# EAGLE design MinimumSistem (EAGLE 6.2)
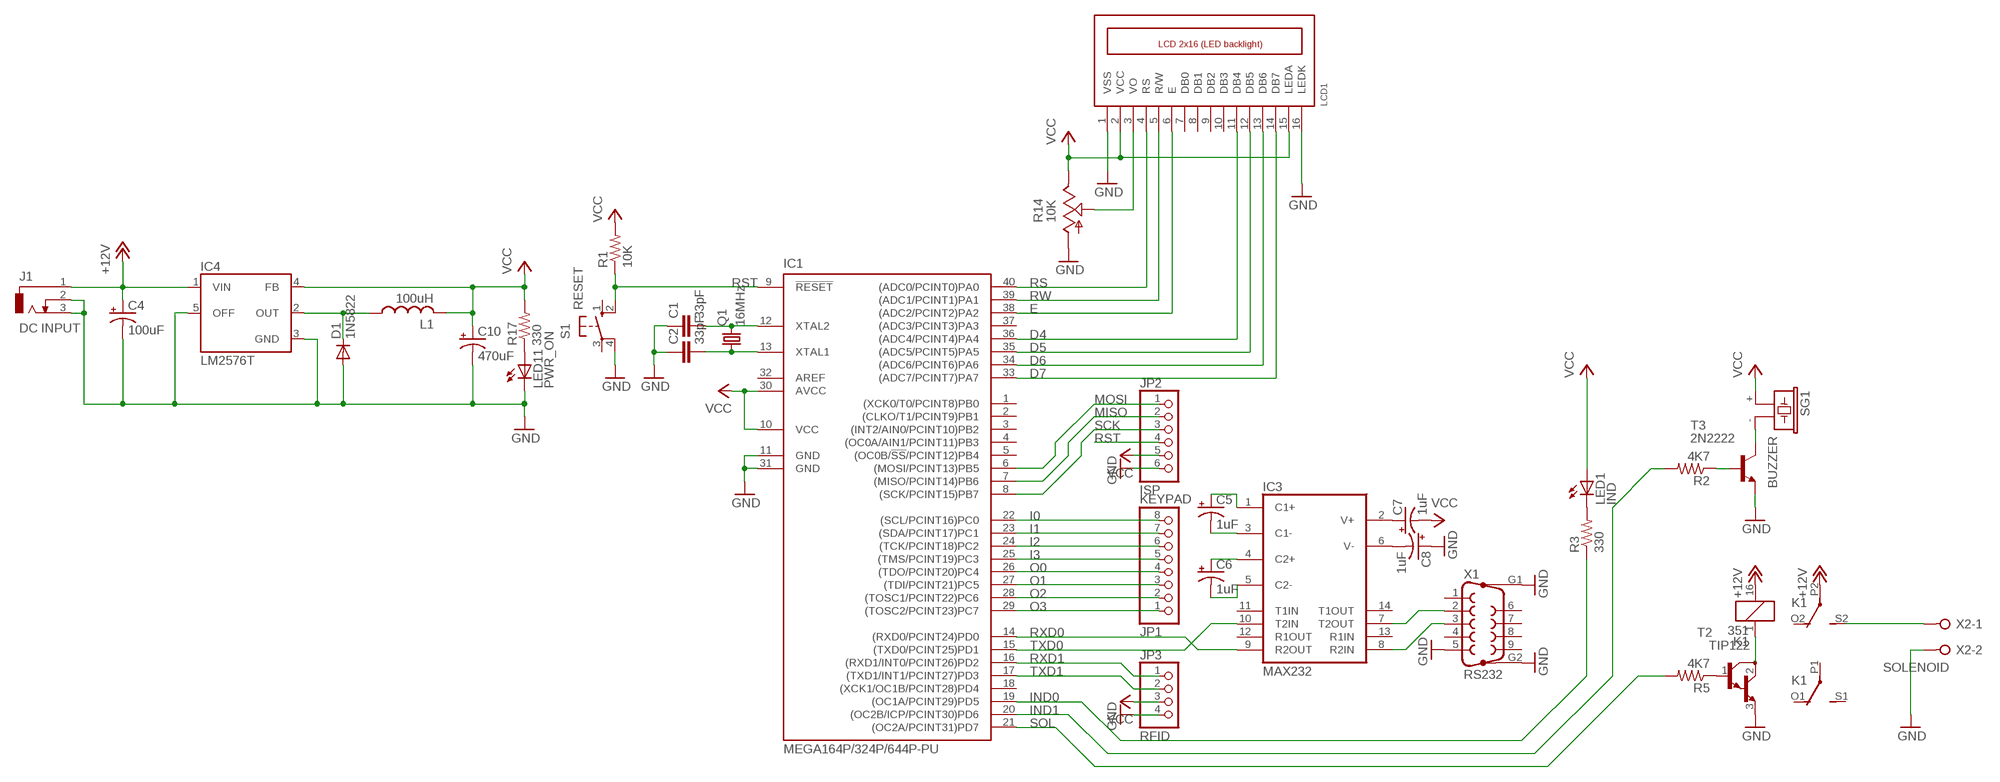
[diagram p0: schematic, sheet 1]

## Parts
C1  33pF  C-EU025-024X044  [C025-024X044]
C2  33pF  C-EU025-024X044  [C025-024X044]
C4  100uF  CPOL-USE2.5-6  [E2,5-6]
C5  1uF  CPOL-USE2-4  [E2-4]
C6  1uF  CPOL-USE2-4  [E2-4]
C7  1uF  CPOL-USE2-4  [E2-4]
C8  1uF  CPOL-USE2-4  [E2-4]
C10  470uF  CPOL-USE3.5-8  [E3,5-8]
D1  1N5822  1N5400  [DO201-15]
IC1  MEGA164P/324P/644P-PU  [DIL40]
IC3  MAX232  [DIL16]
IC4  LM2576T  [TO220-5]
J1  DC INPUT  DCJ0202  [DCJ0202]
JP1  KEYPAD  PINHD-1X8/90  [1X08/90]
JP2  ISP  PINHD-1X6  [1X06]
JP3  RFID  PINHD-1X4  [1X04]
K1  351  [351]
L1  100uH  L-USTJ3-U2  [TJ3-U2]
LCD1  LCD_2X16  LCD_2X16_SIL  [HY-1602F]
LED1  IND  LED5MM  [LED5MM]
LED11  PWR_ON  LED3MM  [LED3MM]
Q1  16MHz  CRYSTALHC49S  [HC49/S]
R1  10K  R-US_0207/10  [0207/10]
R2  4K7  R-US_0207/10  [0207/10]
R3  330  R-US_0207/10  [0207/10]
R5  4K7  R-US_0207/10  [0207/10]
R14  10K  TRIM_US-CA6V  [CA6V]
R17  330  R-US_0207/10  [0207/10]
S1  RESET  10-XX  [B3F-10XX]
SG1  BUZZER  F/CM12P  [F/CM12P]
T2  TIP122  [TO220]
T3  2N2222  [TO92-EBC-OVAL]
X1  RS232  F09HP  [F09HP]
X2  SOLENOID  W237-02P  [W237-132]

## Nets
+12V [power]: C4.+ IC4.1(VIN) J1.1 K1.16 K1.P2(3:P)
D4: IC1.36((ADC4/PCINT4)PA4) LCD1.11(DB4)
D5: IC1.35((ADC5/PCINT5)PA5) LCD1.12(DB5)
D6: IC1.34((ADC6/PCINT6)PA6) LCD1.13(DB6)
D7: IC1.33((ADC7/PCINT7)PA7) LCD1.14(DB7)
E: IC1.38((ADC2/PCINT2)PA2) LCD1.6(E)
GND [gnd]: C1.1 C2.1 C4.- C8.+ C10.- D1.A IC1.11(GND) IC1.31(GND) IC4.3(GND) IC4.5(OFF) J1.2 J1.3 JP2.6 JP3.4 LCD1.1(VSS) LCD1.16(LEDK) LED11.K(C) R14.A S1.4(P1) T2.3(E) T3.E X1.5 X1.G1 X1.G2 X2.2
I0: IC1.22((SCL/PCINT16)PC0) JP1.8
I1: IC1.23((SDA/PCINT17)PC1) JP1.7
I2: IC1.24((TCK/PCINT18)PC2) JP1.6
I3: IC1.25((TMS/PCINT19)PC3) JP1.5
IND0: IC1.19((OC1A/PCINT29)PD5) R3.1
IND1: IC1.20((OC2B/ICP/PCINT30)PD6) R2.2
MISO: IC1.7((MISO/PCINT14)PB6) JP2.2
MOSI: IC1.6((MOSI/PCINT13)PB5) JP2.1
N$1: C1.2 IC1.12(XTAL2) Q1.2
N$2: C2.2 IC1.13(XTAL1) Q1.1
N$3: R5.1 T2.1(B)
N$4: K1.1 T2.2(C)
N$5 [vcc]: LED1.K(C) R3.2
N$6: K1.S2(3:S) X2.1
N$7: R2.1 T3.B
N$16: SG1.- T3.C
N$17: C5.- IC3.3(C1-)
N$18: C6.+ IC3.4(C2+)
N$19: C5.+ IC3.1(C1+)
N$20: C6.- IC3.5(C2-)
N$21: C7.+ IC3.2(V+)
N$22: C8.- IC3.6(V-)
N$23: IC3.7(T2OUT) X1.2
N$24: IC3.8(R2IN) X1.3
N$27: LCD1.3(VO) R14.S
N$32: D1.C IC4.2(OUT) L1.1
N$33: LED11.A R17.1
O0: IC1.26((TDO/PCINT20)PC4) JP1.4
O1: IC1.27((TDI/PCINT21)PC5) JP1.3
O2: IC1.28((TOSC1/PCINT22)PC6) JP1.2
O3: IC1.29((TOSC2/PCINT23)PC7) JP1.1
RS: IC1.40((ADC0/PCINT0)PA0) LCD1.4(RS)
RST: IC1.9(!RESET) JP2.4 R1.1 S1.2(S1)
RW: IC1.39((ADC1/PCINT1)PA1) LCD1.5(R/W)
RXD0: IC1.14((RXD0/PCINT24)PD0) IC3.9(R2OUT)
RXD1: IC1.16((RXD1/INT0/PCINT26)PD2) JP3.1
SCK: IC1.8((SCK/PCINT15)PB7) JP2.3
SOL: IC1.21((OC2A/PCINT31)PD7) R5.2
TXD0: IC1.15((TXD0/PCINT25)PD1) IC3.10(T2IN)
TXD1: IC1.17((TXD1/INT1/PCINT27)PD3) JP3.2
VCC [vcc]: C7.- C10.+ IC1.10(VCC) IC1.30(AVCC) IC4.4(FB) JP2.5 JP3.3 L1.2 LCD1.2(VCC) LCD1.15(LEDA) LED1.A R1.2 R14.E R17.2 SG1.+
Unconnected: IC1.1((XCK0/T0/PCINT8)PB0) IC1.2((CLKO/T1/PCINT9)PB1) IC1.3((INT2/AIN0/PCINT10)PB2) IC1.4((OC0A/AIN1/PCINT11)PB3) IC1.5((OC0B/!SS!/PCINT12)PB4) IC1.18((XCK1/OC1B/PCINT28)PD4) IC1.37((ADC3/PCINT3)PA3) IC3.11(T1IN) IC3.12(R1OUT) IC3.13(R1IN) IC3.14(T1OUT) K1.O1(2:O) K1.O2(3:O) K1.P1(2:P) K1.S1(2:S) LCD1.7(DB0) LCD1.8(DB1) LCD1.9(DB2) LCD1.10(DB3) S1.1(S) S1.3(P) X1.1 X1.4 X1.6 X1.7 X1.8 X1.9

## Power pins joined to a net without a drawn wire
AREF: IC1.32(AREF)
GND: IC3.15(GND)
VCC: IC3.16(VCC)

## Library data of the parts
C1 C2 = resistor:C-EU: CAPACITOR, European symbol
C4-C8 C10 = resistor:CPOL-US: POLARIZED CAPACITOR, American symbol
D1 = diode:1N5400: DIODE standard rectifier, 3 A, 50 V (Motorola)
IC1 = avr-7:MEGA164P/324P/644P-PU
IC3 = maxim:MAX232: RS232 TRANSEIVER; MF: MAXIM; MPN: MAX232ACPE+; OC_FARNELL: 9723773; OC_NEWARK: 68K4544
IC4 = v-reg-3:LM2576: National Semiconductor <http://www.national.com> 3.0A "Simple Switcher"(c) 52kHz, Vout 1.23-37V (HV: 57V), Vin 40V (HV: 60V), 50µA standby current
J1 = con-jack:DCJ0202: DC POWER JACK Source: DCJ0202.pdf; OC_FARNELL: unknown; OC_NEWARK: unknown
JP1 = pinhead:PINHD-1X8: PIN HEADER
JP2 = pinhead:PINHD-1X6: PIN HEADER
JP3 = pinhead:PINHD-1X4: PIN HEADER
K1 = relay:351: RELAY 2 x switch, Omron; OC_FARNELL: unknown; OC_NEWARK: unknown
L1 = resistor:L-US: INDUCTOR, American symbol
LCD1 = lcd_2x16_led_backlight:LCD_2X16_SIL
LED1 LED11 = led:LED: LED OSRAM: - CHIPLED LG R971, LG N971, LY N971, LG Q971, LY Q971, LO R971, LY R971 LH N974, LH R974 LS Q976, LO Q976, LY Q976 LO Q996 - Hyper CHIPLED LW Q18S LB Q993, LB Q99A, LB R99A - SideLED LS A670, LO A670, LY A670, LG A670, LP A670 LB A673, LV A673, LT A673, LW A673 LH A674 LY A675 LS A676, LA A676, LO A676, LY A676, LW A676 LS A679, LY A679, LG A679 - Hyper Micro SIDELED® LS Y876, LA Y876, LO Y876, LY Y876 LT Y87S - SmartLED LW L88C, LW L88S LB L89C, LB L89S, LG L890 LS L89K, LO L89K, LY L89K LS L896, LA L896, LO L896, LY L896 - TOPLED LS T670, LO T670, LY T670, LG T670, LP T670 LSG T670, LSP T670, LSY T670, LOP T670, LYG T670 LG T671, LOG T671, LSG T671 LB T673, LV T673, LT T673, LW T673 LH T674 LS T676, LA T676, LO T676, LY T676, LB T676, LH T676, LSB T676, LW T676 LB T67C, LV T67C, LT T67C, LS T67K, LO T67K, LY T67K, LW E67C LS E67B, LA E67B, LO E67B, LY E67B, LB E67C, LV E67C, LT E67C LW T67C LS T679, LY T679, LG T679 LS T770, LO T770, LY T770, LG T770, LP T770 LB T773, LV T773, LT T773, LW T773 LH T774 LS E675, LA E675, LY E675, LS T675 LS T776, LA T776, LO T776, LY T776, LB T776 LHGB T686 LT T68C, LB T68C - Hyper Mini TOPLED® LB M676 - Mini TOPLED Santana® LG M470 LS M47K, LO M47K, LY M47K Source: http://www.osram.convergy.de LUXEON: - LUMILED® LXK2-PW12-R00, LXK2-PW12-S00, LXK2-PW14-U00, LXK2-PW14-V00 LXK2-PM12-R00, LXK2-PM12-S00, LXK2-PM14-U00 LXK2-PE12-Q00, LXK2-PE12-R00, LXK2-PE12-S00, LXK2-PE14-T00, LXK2-PE14-U00 LXK2-PB12-K00, LXK2-PB12-L00, LXK2-PB12-M00, LXK2-PB14-N00, LXK2-PB14-P00, LXK2-PB14-Q00 LXK2-PR12-L00, LXK2-PR12-M00, LXK2-PR14-Q00, LXK2-PR14-R00 LXK2-PD12-Q00, LXK2-PD12-R00, LXK2-PD12-S00 LXK2-PH12-R00, LXK2-PH12-S00 LXK2-PL12-P00, LXK2-PL12-Q00, LXK2-PL12-R00 Source: www.luxeon.com KINGBRIGHT: KA-3528ASYC Source: www.kingbright.com
Q1 = crystal:CRYSTAL: CRYSTAL; OC_FARNELL: 1667008; OC_NEWARK: unknown
R1-R3 R5 R17 = resistor:R-US_: RESISTOR, American symbol
R14 = pot:TRIM_US-: POTENTIOMETER
S1 = switch-omron:10-XX: OMRON SWITCH; MPN: B3F-1000; OC_FARNELL: 176432; OC_NEWARK: 36M3542
SG1 = buzzer:F/CM12P: BUZZER Source: Buerklin; OC_FARNELL: unknown; OC_NEWARK: unknown
T2 = transistor-neu-to92:TIP122: NPN BIPOLAR DARLINGTON TRANSISTOR
T3 = adafruit:2N2222: NPN TRANSISTOR Big oval pads
X1 = con-subd:F09HP: SUB-D; OC_FARNELL: unknown; OC_NEWARK: unknown
X2 = con-wago-508:W237-02P: WAGO SREW CLAMP; OC_FARNELL: unknown; OC_NEWARK: unknown

## Net classes
0 default: width 0.5 mm
1 power: width 1 mm
2 gnd: width 0.6 mm
3 vcc: width 0.7 mm

## Board
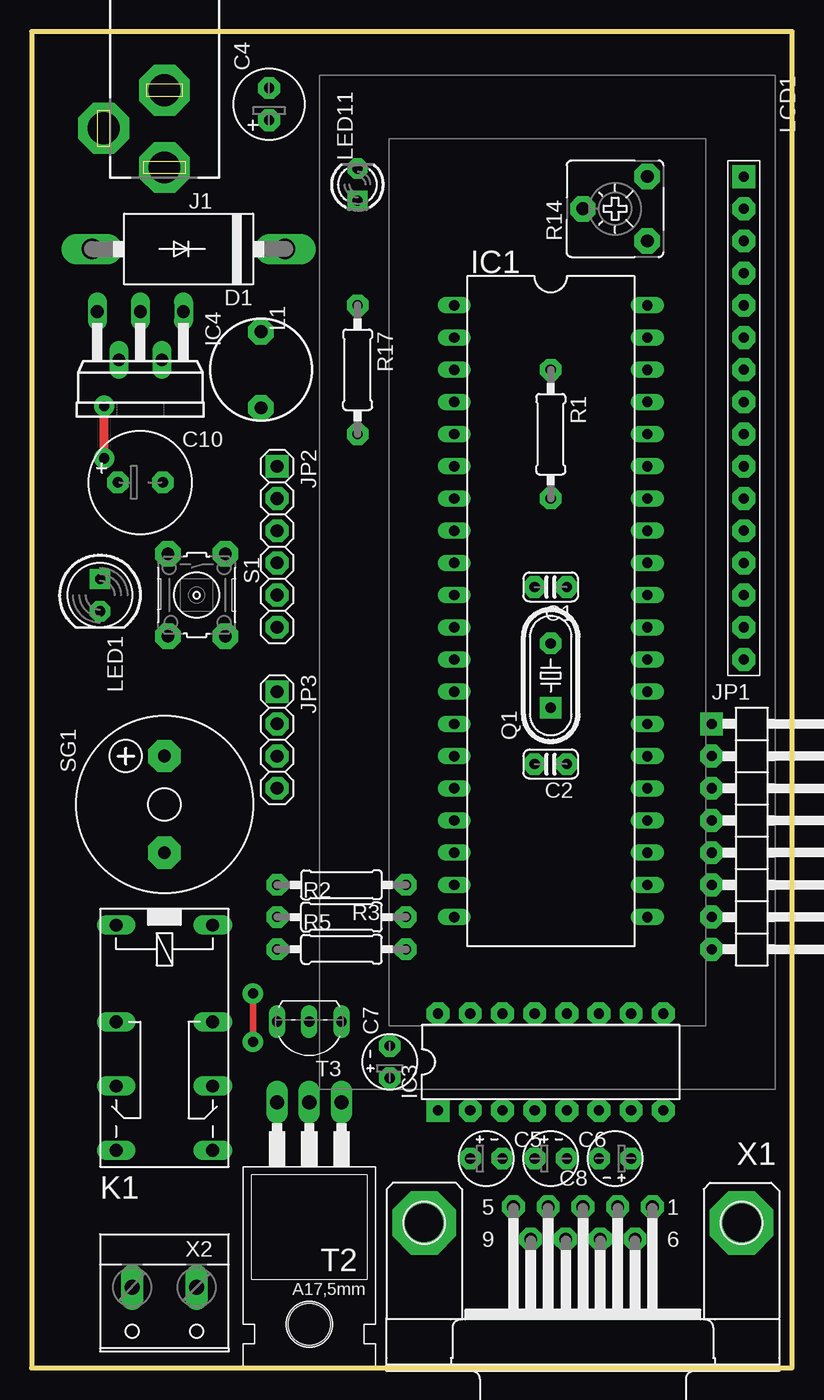
[diagram p1: board, top side]
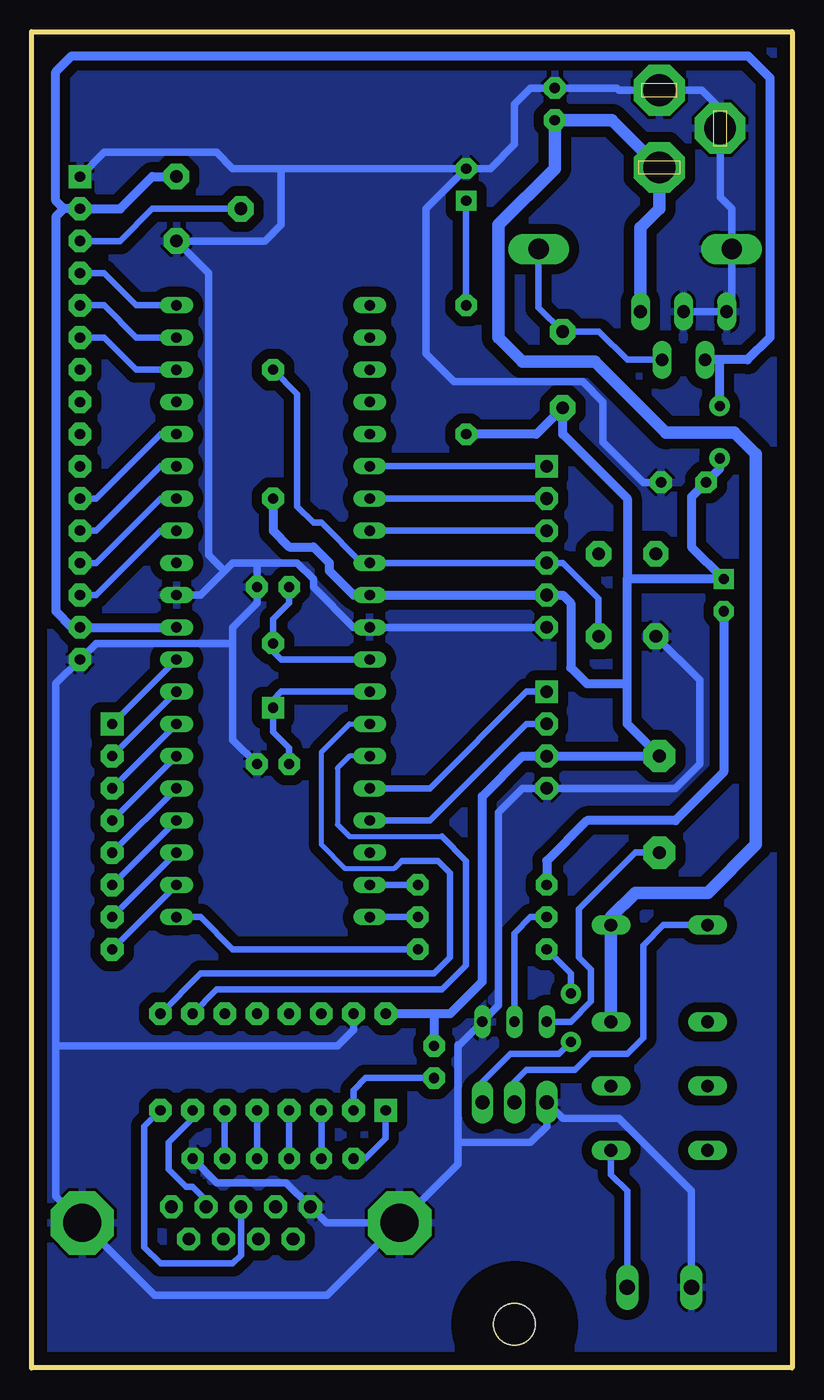
[diagram p2: board, bottom side, seen from below]

Size 60.01 x 105.41 mm. Coordinates in mm from the lower left corner, seen from the top.
Outline: 0,0 60.01,0 60.01,105.41 0,105.41 0,0
Copper layers (1*16): Top 0.035mm / dielectric 1.5mm / Bottom 0.035mm
Design rules: minimum track width 0.5mm, minimum drill 0.8mm, track to track 8mil, track to pad 8mil, pad to pad 8mil, via to via 8mil, smd to smd 8mil, copper to edge 40mil, drill to drill 8mil, minimum pad ring 10mil, minimum via ring 8mil, stop-mask expansion 4mil, vias tented up to drill 0mil, thermal gap 10mil

### Footprints (pad centres in the part's own frame; a part is rotated, then mirrored left to right if it is on the bottom)
C025-024X044 = drill 0.8 pad 1.7 octagon: 1 -1.27,0; 2 1.27,0
E2,5-6 = drill 0.8 pad 1.7 octagon: + -1.27,0; - 1.27,0
E2-4 = drill 0.8 pad 1.7 octagon: + -1.27,0; - 1.27,0
E3,5-8 = drill 0.813 pad 1.7 octagon: + -1.778,0; - 1.778,0
DO201-15 = drill 1.6 long: A 7.62,0; C -7.62,0
DIL40 = drill 0.813 long: 1 -24.13,-7.62; 2 -21.59,-7.62; 3 -19.05,-7.62; 4 -16.51,-7.62; 5 -13.97,-7.62; 6 -11.43,-7.62; 7 -8.89,-7.62; 8 -6.35,-7.62; 9 -3.81,-7.62; 10 -1.27,-7.62; 11 1.27,-7.62; 12 3.81,-7.62; 13 6.35,-7.62; 14 8.89,-7.62; 15 11.43,-7.62; 16 13.97,-7.62; 17 16.51,-7.62; 18 19.05,-7.62; 19 21.59,-7.62; 20 24.13,-7.62; 21 24.13,7.62; 22 21.59,7.62; 23 19.05,7.62; 24 16.51,7.62; 25 13.97,7.62; 26 11.43,7.62; 27 8.89,7.62; 28 6.35,7.62; 29 3.81,7.62; 30 1.27,7.62; 31 -1.27,7.62; 32 -3.81,7.62; 33 -6.35,7.62; 34 -8.89,7.62; 35 -11.43,7.62; 36 -13.97,7.62; 37 -16.51,7.62; 38 -19.05,7.62; 39 -21.59,7.62; 40 -24.13,7.62
DIL16 = drill 0.8 pad 1.8 square: 1 -8.89,-3.81 | drill 0.8 pad 1.8 octagon: 2 -6.35,-3.81; 3 -3.81,-3.81; 4 -1.27,-3.81; 5 1.27,-3.81; 6 3.81,-3.81; 7 6.35,-3.81; 8 8.89,-3.81; 9 8.89,3.81; 10 6.35,3.81; 11 3.81,3.81; 12 1.27,3.81; 13 -1.27,3.81; 14 -3.81,3.81; 15 -6.35,3.81; 16 -8.89,3.81
TO220-5 = drill 1 long: 1 -3.4,-8.4; 2 -1.7,-4.59; 3 0,-8.4; 4 1.7,-4.59; 5 3.4,-8.4
DCJ0202 = drill 2.5 pad 4 octagon: 1 0,3.1; 2 4.8,0; 3 0,-3
1X08/90 = drill 0.8 pad 1.8 square: 1 -8.89,-3.81 | drill 0.8 pad 1.8 octagon: 2 -6.35,-3.81; 3 -3.81,-3.81; 4 -1.27,-3.81; 5 1.27,-3.81; 6 3.81,-3.81; 7 6.35,-3.81; 8 8.89,-3.81
1X06 = drill 1 pad 1.8 square: 1 -6.35,0 | drill 1 pad 1.8 octagon: 2 -3.81,0; 3 -1.27,0; 4 1.27,0; 5 3.81,0; 6 6.35,0
1X04 = drill 1 pad 1.8 square: 1 -3.81,0 | drill 1 pad 1.8 octagon: 2 -1.27,0; 3 1.27,0; 4 3.81,0
351 = drill 1.016 long: 1 -3.81,-3.81; 16 -3.81,3.81; O1 8.89,-3.81; O2 8.89,3.81; P1 3.81,-3.81; P2 3.81,3.81; S1 13.97,-3.81; S2 13.97,3.81
TJ3-U2 = drill 1 pad 2 octagon: 1 -3,0; 2 3,0
HY-1602F = drill 0.8 pad 1.8 square: 1 2.54,0 | drill 0.8 pad 1.8 octagon: 2 5.08,0; 3 7.62,0; 4 10.16,0; 5 12.7,0; 6 15.24,0; 7 17.78,0; 8 20.32,0; 9 22.86,0; 10 25.4,0; 11 27.94,0; 12 30.48,0; 13 33.02,0; 14 35.56,0; 15 38.1,0; 16 40.64,0
LED5MM = drill 0.8 pad 1.6 square: A -1.27,0 | drill 0.8 pad 1.6 octagon: K 1.27,0
LED3MM = drill 0.8 pad 1.6 square: A -1.27,0 | drill 0.8 pad 1.6 octagon: K 1.27,0
HC49/S = drill 0.8 pad 1.7 square: 1 -2.54,0 | drill 0.8 pad 1.7 octagon: 2 2.54,0
0207/10 = drill 0.8 pad 1.7 octagon: 1 -5.08,0; 2 5.08,0
CA6V = drill 1 pad 2 octagon: A -2.54,-2.54; E 2.54,-2.54; S 0,2.54
B3F-10XX = drill 1 pad 2 octagon: 1 -3.251,2.261; 2 3.251,2.261; 3 -3.251,-2.261; 4 3.251,-2.261
F/CM12P = drill 1.016 pad 2.54 octagon: + 3.81,0; - -3.81,0
TO220 = drill 1.118 long: 1 -2.54,-6.35; 2 0,-6.35; 3 2.54,-6.35 | hole 3.302: 0,11.176
TO92-EBC-OVAL = drill 0.813 long: B 0,-1.27; C 2.54,-1.27; E -2.54,-1.27
F09HP = drill 1 pad 1.8 octagon: 1 -5.486,-1.27; 2 -2.743,-1.27; 3 0,-1.27; 4 2.743,-1.27; 5 5.486,-1.27; 6 -4.115,1.27; 7 -1.372,1.27; 8 1.372,1.27; 9 4.115,1.27 | drill 3 pad 5 octagon: G1 -12.522,0; G2 12.522,0
W237-132 = drill 1.194 long: 1 -2.54,-0.635; 2 2.54,-0.635

### Placement (x,y rotation side)
C1  40.96,61.59 180 top
C2  40.96,47.62 180 top
C4  18.73,99.7 90 top
C5  35.88,16.51 0 top
C6  40.96,16.51 0 top
C7  28.26,24.13 90 top
C8  46.04,16.51 180 top
C10  8.57,69.85 0 top
D1  12.38,88.27 180 top
IC1  40.96,59.69 270 top
IC3  40.96,24.13 0 top
IC4  8.57,74.93 180 top
J1  10.48,97.79 180 top
JP1  57.47,41.91 270 top
JP2  19.37,64.77 270 top
JP3  19.37,49.53 270 top
K1  10.48,31.12 270 top
L1  18.1,78.74 270 top
LCD1  56.2,96.52 270 top
LED1  5.4,60.96 270 top
LED11  25.72,93.34 90 top
Q1  40.96,54.61 90 top
R1  40.96,73.66 270 top
R2  24.45,35.56 0 top
R3  24.45,38.1 180 top
R5  24.45,33.02 0 top
R14  46.04,91.44 90 top
R17  25.72,78.74 270 top
S1  13.02,60.96 270 top
SG1  10.48,44.45 90 top
T2  21.91,14.61 180 top
T3  21.91,26.04 180 top
X1  43.5,11.43 180 top
X2  10.48,5.72 180 top

### Tracks (layer width: path | path; a pad name or v marks a point on that pad's centre or on a via)
+12V
  Bottom 1: K1.P2 K1.16 14.29,35.56 12.38,37.47 6.67,37.47 2.86,41.27 2.86,72.07 4.55,73.77 9.95,73.77 15.56,79.38 21.27,79.38 23.18,81.28 23.18,90.17 18.73,94.61 C4.+ 14.21,98.42 J1.1 10.48,91.44 11.97,89.95 IC4.1
D4
  Bottom 0.5: IC1.36 49.85,73.66 54.93,68.58 LCD1.11
D5
  Bottom 0.5: IC1.35 49.85,71.12 54.93,66.04 LCD1.12
D6
  Bottom 0.5: IC1.34 49.85,68.58 54.93,63.5 LCD1.13
D7
  Bottom 0.5: IC1.33 49.85,66.04 54.93,60.96 LCD1.14
E
  Bottom 0.5: LCD1.6 54.29,81.28 51.75,78.74 IC1.38
GND
  Bottom 0.6: C10.- 11.75,69.85 14.92,73.03 14.92,76.2 16.51,77.79 26.67,77.79 28.89,80.01 28.89,91.44 LED11.K | X1.G2 36.69,5.72 50.3,5.72 X1.G1 58.1,13.51 58.1,25.4 | 58.1,25.4 58.1,53.98 LCD1.16 54.93,57.15 44.13,57.15 | S1.4 7.3,54.25 7.3,47.62 9.21,45.72 JP3.4 21.27,45.72 23.18,43.81 23.18,28.57 T3.E 26.27,25.48 26.35,25.48 26.35,17.78 | X1.G2 26.35,16.05 26.35,17.78 | 44.13,57.15 44.13,58.42 42.23,60.33 C1.1 42.23,63.5 | X1.G2 36.74,11.43 X1.5 39.92,14.61 45.4,14.61 C8.+ | 44.13,57.15 44.13,49.53 C2.1 | JP2.6 IC1.11 34.61,58.42 37.78,61.59 37.78,62.23 39.05,63.5 42.23,63.5 | 44.77,62.87 46.67,60.96 IC1.31 | 58.1,25.4 35.88,25.4 34.61,26.67 IC3.15 | IC4.3 IC4.5 4.76,83.74 D1.A 4.76,91.44 5.68,92.36 J1.2 5.68,99.34 7.13,100.79 J1.3 13.65,100.79 13.83,100.97 C4.- 20.64,100.97 21.91,99.7 21.91,96.52 23.81,94.61 LED11.K | 42.23,63.5 44.13,63.5 44.77,62.87 | 44.77,62.87 46.04,64.13 46.04,86.36 R14.A 41.59,88.9 40.32,90.17 40.32,94.61 | X2.2 7.94,13.97 13.65,19.69 18.1,19.69 T2.3 19.37,19.05 20.64,17.78 26.35,17.78 | LED11.K 40.32,94.61 | 40.32,94.61 44.13,94.61 45.4,95.89 54.29,95.89 LCD1.1
  pour Bottom (isolate 0.8): 0,0 60.01,0 60.01,105.41 0,105.41
I0
  Bottom 0.5: JP1.8 IC1.22
I1
  Bottom 0.5: JP1.7 IC1.23
I2
  Bottom 0.5: JP1.6 IC1.24
I3
  Bottom 0.5: JP1.5 IC1.25
IND0
  Bottom 0.5: R3.1 IC1.19
IND1
  Bottom 0.5: IC1.20 R2.2
MISO
  Bottom 0.5: IC1.7 JP2.2
MOSI
  Bottom 0.5: JP2.1 IC1.6
N$1
  Bottom 0.5: IC1.12 40.32,55.88 40.96,56.52 Q1.2 40.96,59.05 39.69,60.33 C1.2
N$2
  Bottom 0.5: IC1.13 40.32,53.34 40.96,52.7 Q1.1 40.96,50.16 39.69,48.9 C2.2
N$3  (via drill 0.8 pad 1.6)
  Top 0.5: v17.46,25.72 v17.46,29.53
  Bottom 0.5: T2.1 24.45,22.54 22.23,24.77 18.42,24.77 v17.46,25.72 | v17.46,29.53 17.46,31.12 R5.1
N$4
  Bottom 0.5: T2.2 21.91,22.54 20.95,23.5 17.15,23.5 15.87,24.77 13.02,24.77 11.75,26.04 11.75,33.34 10.16,34.92 K1.1
N$5
  Bottom 0.7: LED1.K 5.4,46.99 9.21,43.18 16.19,43.18 19.37,40 R3.2
N$6
  Bottom 0.5: K1.S2 14.29,15.24 13.02,13.97 X2.1
N$7
  Bottom 0.5: T3.B 21.91,34.29 20.64,35.56 R2.1
N$8
  pour Bottom (isolate 0.8): 0,105.41 60.01,105.41 60.01,0 0,0
N$16
  Bottom 0.5: SG1.- 12.38,40.64 16.83,36.2 16.83,32.39 15.87,31.43 15.87,28.89 17.46,27.3 T3.C
N$17
  Bottom 0.5: IC3.3 C5.-
N$18
  Bottom 0.5: C6.+ IC3.4
N$19
  Bottom 0.5: C5.+ 33.65,16.51 32.07,18.1 IC3.1
N$20
  Bottom 0.5: C6.- IC3.5
N$21
  Bottom 0.5: C7.+ 33.65,22.86 34.61,21.91 IC3.2
N$22
  Bottom 0.5: C8.- IC3.6
N$23
  Bottom 0.5: IC3.7 47.31,19.69 49.21,17.78 49.21,15.67 47.83,14.29 47.31,14.29 46.24,13.22 X1.2
N$24
  Bottom 0.5: X1.3 43.5,8.89 44.13,8.26 49.85,8.26 51.12,9.53 51.12,19.05 IC3.8
N$27
  Bottom 0.5: R14.S 50.48,91.44 53.02,88.9 LCD1.3
N$32
  Bottom 0.5: IC4.2 13.02,79.52 15.24,81.74 L1.1 20,83.64 D1.C
N$33
  Bottom 0.5: R17.1 LED11.A
O0
  Bottom 0.5: JP1.4 IC1.26
O1
  Bottom 0.5: JP1.3 IC1.27
O2
  Bottom 0.5: IC1.28 JP1.2
O3
  Bottom 0.5: JP1.1 IC1.29
RS
  Bottom 0.5: IC1.40 51.75,83.82 54.29,86.36 LCD1.4
RST
  Bottom 0.5: S1.2 15.28,60.68 18.1,63.5 JP2.4 IC1.9 33.97,63.5 37.15,66.67 37.78,66.67 39.05,67.94 39.05,76.83 R1.1
RW
  Bottom 0.5: IC1.39 51.75,81.28 54.29,83.82 LCD1.5
RXD0
  Bottom 0.4: 30.8,40 31.43,39.37 35.24,39.37 37.15,41.27 37.15,48.58 34.93,50.8 IC1.14
  Bottom 0.5: IC3.9 46.67,31.12 28.26,31.12 26.99,32.39 26.99,39.03 27.96,40 30.8,40
RXD1
  Bottom 0.5: IC1.16 28.58,45.72 20.95,53.34 JP3.1
SCK
  Bottom 0.5: IC1.8 JP2.3
SOL
  Bottom 0.5: R5.2 44.13,33.02 46.67,35.56 IC1.21
TXD0
  Bottom 0.4: 27.62,41.91 34.93,41.91 35.88,42.86 35.88,47.31 34.93,48.26 IC1.15
  Bottom 0.5: IC3.10 45.4,29.84 27.62,29.84 25.72,31.75 25.72,40 27.62,41.91
TXD1
  Bottom 0.5: IC1.17 28.58,43.18 20.95,50.8 JP3.2
VCC  (via drill 0.8 pad 1.6)
  Top 0.7: v5.71,71.75 v5.71,75.88
  Bottom 0.7: 28.26,27.94 26.99,27.94 24.45,30.48 24.45,45.09 21.27,48.26 JP3.3 SG1.+ 13.02,50.8 13.02,53.98 | 28.26,27.94 IC3.16 | 5.71,79.52 3.52,79.52 1.76,81.28 1.76,101.77 3.49,103.5 56.83,103.5 58.1,102.23 58.1,92.08 57.47,91.44 | 5.71,79.52 IC4.4 | 13.02,62.23 13.02,68.58 18.1,73.66 L1.2 20.18,73.66 R17.2 | 28.26,27.94 C7.- | R14.E 50.48,93.98 53.02,91.44 LCD1.2 57.47,91.44 | 13.02,62.23 LED1.A 7.94,64.77 7.94,68.71 C10.+ 5.71,70.93 v5.71,71.75 | 13.02,53.98 13.02,62.23 | IC1.30 LCD1.15 56.83,58.42 58.1,59.69 58.1,90.81 57.47,91.44 | 13.02,53.98 16.19,53.98 17.46,55.24 17.46,60.33 18.1,60.96 JP2.5 IC1.10 34.61,60.96 36.51,62.87 36.51,63.5 37.78,64.77 39.69,64.77 40.96,66.04 R1.2 | v5.71,75.88 5.71,79.52